# EAGLE design jack (EAGLE 7.3.0)
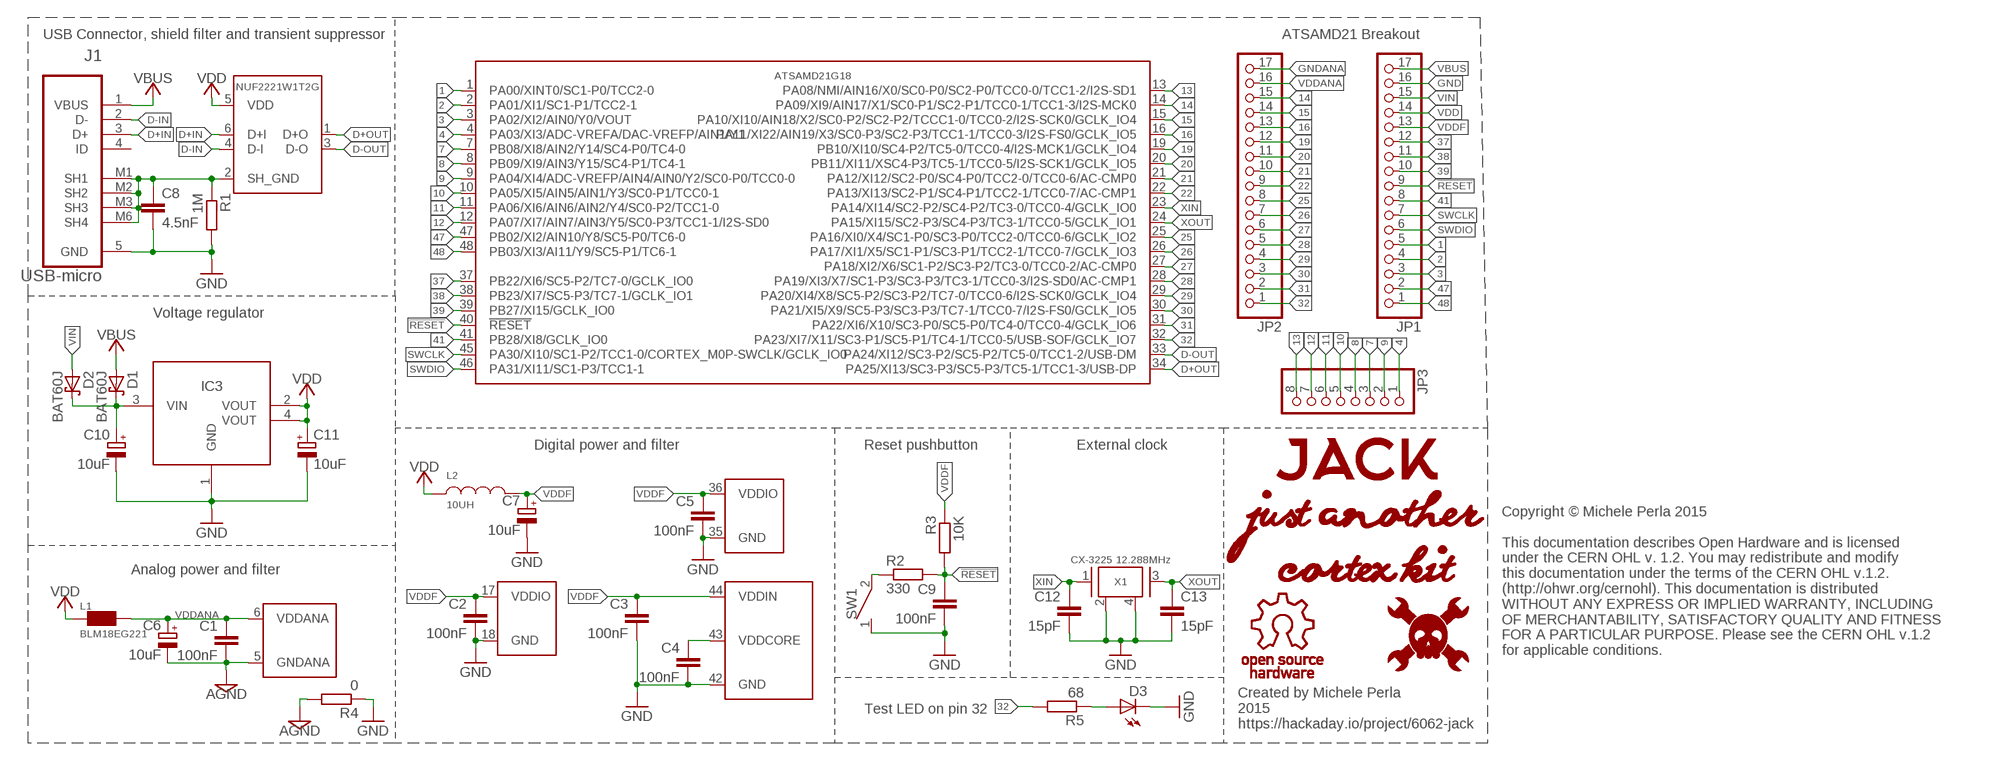
[diagram p0: schematic, sheet 1]

## Parts
C1  100nF  C-EU  [C0402]
C2  100nF  C-EU  [C0402]
C3  100nF  C-EU  [C0402]
C4  100nF  C-EU  [C0402]
C5  100nF  C-EU  [C0402]
C6  10uF  CPOL-EUCT3216  [CT3216]
C7  10uF  CPOL-EUCT3216  [CT3216]
C8  4.5nF  C-EU  [C0402]
C9  100nF  C-EU  [C0402]
C10  10uF  CPOL-EUCT3216  [CT3216]
C11  10uF  CPOL-EUCT3216  [CT3216]
C12  15pF  C-EU  [C0402]
C13  15pF  C-EU  [C0402]
D1  BAT60J  [SOD323_ST]
D2  BAT60J  [SOD323_ST]
D3  LED  [LED-0603]
IC1  NUF2221W1T2G  [SOT-363]
IC2  ATSAMD21G18  [TQFP48]
IC3  LDO  [SOT-223-3]
J1  USB-micro  47346-0001  [MOLEX_47346-0001]
JP1  PINHD-1X17  [1X17]
JP2  PINHD-1X17  [1X17]
JP3  PINHD-1X8  [1X08]
L1  BLM18EG221  L  [0603]
L2  10UH  ELLVFG100MC-VXG  [IND_ELLVXG]
R1  1M  R-EU  [R0603]
R2  330  R-EU  [R0603]
R3  10K  R-EU  [R0603]
R4  0  R-EU  [R0603]
R5  68  R-EU  [R0603]
SW1  SPST3.5X6MM  [SWITCH-SMD-3.5X6MM]
U$3  JACK-LOGO  [JACK-LOGO]
U$5  HAD-LOGO  [HAD-LOGO]
U$6  OSHW-LOGO  [OSHW-LOGO]
X1  CX-3225 12.288MHz  XTALCX-3225  [CX-3225]

## Nets
1: IC2.1(IO:PA00/XINT0/SC1-P0/TCC2-0) JP1.5
2: IC2.2(IO:PA01/XI1/SC1-P1/TCC2-1) JP1.4
3: IC2.3(IO:PA02/XI2/AIN0/Y0/VOUT) JP1.3
4: IC2.4(IO:PA03/XI3/ADC-VREFA/DAC-VREFP/AIN1/Y1) JP3.1
7: IC2.7(IO:PB08/XI8/AIN2/Y14/SC4-P0/TC4-0) JP3.3
8: IC2.8(IO:PB09/XI9/AIN3/Y15/SC4-P1/TC4-1) JP3.4
9: IC2.9(IO:PA04/XI4/ADC-VREFP/AIN4/AIN0/Y2/SC0-P0/TCC0-0) JP3.2
10: IC2.10(IO:PA05/XI5/AIN5/AIN1/Y3/SC0-P1/TCC0-1) JP3.5
11: IC2.11(IO:PA06/XI6/AIN6/AIN2/Y4/SC0-P2/TCC1-0) JP3.6
12: IC2.12(IO:PA07/XI7/AIN7/AIN3/Y5/SC0-P3/TCC1-1/I2S-SD0) JP3.7
13: IC2.13(IO:PA08/NMI/AIN16/X0/SC0-P0/SC2-P0/TCC0-0/TCC1-2/I2S-SD1) JP3.8
14: IC2.14(IO:PA09/XI9/AIN17/X1/SC0-P1/SC2-P1/TCC0-1/TCC1-3/I2S-MCK0) JP2.15
15: IC2.15(IO:PA10/XI10/AIN18/X2/SC0-P2/SC2-P2/TCCC1-0/TCC0-2/I2S-SCK0/GCLK_IO4) JP2.14
16: IC2.16(IO:PA11/XI22/AIN19/X3/SC0-P3/SC2-P3/TCC1-1/TCC0-3/I2S-FS0/GCLK_IO5) JP2.13
19: IC2.19(IO:PB10/XI10/SC4-P2/TC5-0/TCC0-4/I2S-MCK1/GCLK_IO4) JP2.12
20: IC2.20(IO:PB11/XI11/XSC4-P3/TC5-1/TCC0-5/I2S-SCK1/GCLK_IO5) JP2.11
21: IC2.21(IO:PA12/XI12/SC2-P0/SC4-P0/TCC2-0/TCC0-6/AC-CMP0) JP2.10
22: IC2.22(IO:PA13/XI13/SC2-P1/SC4-P1/TCC2-1/TCC0-7/AC-CMP1) JP2.9
25: IC2.25(IO:PA16/XI0/X4/SC1-P0/SC3-P0/TCC2-0/TCC0-6/GCLK_IO2) JP2.8
26: IC2.26(IO:PA17/XI1/X5/SC1-P1/SC3-P1/TCC2-1/TCC0-7/GCLK_IO3) JP2.7
27: IC2.27(IO:PA18/XI2/X6/SC1-P2/SC3-P2/TC3-0/TCC0-2/AC-CMP0) JP2.6
28: IC2.28(IO:PA19/XI3/X7/SC1-P3/SC3-P3/TC3-1/TCC0-3/I2S-SD0/AC-CMP1) JP2.5
29: IC2.29(IO:PA20/XI4/X8/SC5-P2/SC3-P2/TC7-0/TCC0-6/I2S-SCK0/GCLK_IO4) JP2.4
30: IC2.30(IO:PA21/XI5/X9/SC5-P3/SC3-P3/TC7-1/TCC0-7/I2S-FS0/GCLK_IO5) JP2.3
31: IC2.31(IO:PA22/XI6/X10/SC3-P0/SC5-P0/TC4-0/TCC0-4/GCLK_IO6) JP2.2
32: IC2.32(IO:PA23/XI7/X11/SC3-P1/SC5-P1/TC4-1/TCC0-5/USB-SOF/GCLK_IO7) JP2.1 R5.2
37: IC2.37(IO:PB22/XI6/SC5-P2/TC7-0/GCLK_IO0) JP1.12
38: IC2.38(IO:PB23/XI7/SC5-P3/TC7-1/GCLK_IO1) JP1.11
39: IC2.39(IO:PB27/XI15/GCLK_IO0) JP1.10
41: IC2.41(IO:PB28/XI8/GCLK_IO0) JP1.8
47: IC2.47(IO:PB02/XI2/AIN10/Y8/SC5-P0/TC6-0) JP1.2
48: IC2.48(IO:PB03/XI3/AI11/Y9/SC5-P1/TC6-1) JP1.1
!RESET: C9.1 IC2.40(IO:!RESET) JP1.9 R2.2 R3.2
D+IN: IC1.6(D+I) J1.3(D+)
D+OUT: IC1.1(D+O) IC2.34(IO:PA25/XI13/SC3-P3/SC5-P3/TC5-1/TCC1-3/USB-DP)
D-IN: IC1.4(D-I) J1.2(D-)
D-OUT: IC1.3(D-O) IC2.33(IO:PA24/XI12/SC3-P2/SC5-P2/TC5-0/TCC1-2/USB-DM)
GND: C2.2 C3.2 C4.2 C5.2 C7.- C8.2 C9.2 C10.- C11.- C12.2 C13.2 D3.C IC2.18(PWR-IO1:GND) IC2.35(PWR-IO2:GND) IC2.42(PWR-IN-CORE:GND) IC3.1(GND) J1.5(GND) JP1.16 R1.2 R4.1 SW1.1 X1.2(GND) X1.4(GND)
GNDANA: C1.2 C6.- IC2.5(PWR-ANA:GNDANA) JP2.17 R4.2 ; supply symbol labelled AGND
LDOIN: C10.+ D1.C D2.C IC3.3(VIN)
N$1: D3.A R5.1
N$3: R2.1 SW1.2
SH_GND: C8.1 IC1.2(SH_GND) J1.M1(SH1) J1.M2(SH2) J1.M3(SH3) J1.M6(SH4) R1.1
SWCLK: IC2.45(IO:PA30/XI10/SC1-P2/TCC1-0/CORTEX_M0P-SWCLK/GCLK_IO0) JP1.7
SWDIO: IC2.46(IO:PA31/XI11/SC1-P3/TCC1-1) JP1.6
VBUS: D1.A J1.1(VBUS) JP1.17
VDD: C11.+ IC1.5(VDD) IC3.2(VOUT) IC3.4(VOUT) JP1.14 L1.1 L2.2
VDDANA: C1.1 C6.+ IC2.6(PWR-ANA:VDDANA) JP2.16 L1.2
VDDCORE: C4.1 IC2.43(PWR-IN-CORE:VDDCORE)
VDDF: C2.1 C3.1 C5.1 C7.+ IC2.17(PWR-IO1:VDDIO) IC2.36(PWR-IO2:VDDIO) IC2.44(PWR-IN-CORE:VDDIN) JP1.13 L2.1 R3.1
VIN: D2.A JP1.15
XIN: C12.1 IC2.23(IO:PA14/XI14/SC2-P2/SC4-P2/TC3-0/TCC0-4/GCLK_IO0) X1.1
XOUT: C13.1 IC2.24(IO:PA15/XI15/SC2-P3/SC4-P3/TC3-1/TCC0-5/GCLK_IO1) X1.3
Unconnected: J1.4(ID)

## Notes on the sheet
- USB Connector, shield filter and transient suppressor | ATSAMD21 Breakout
- Voltage regulator
- Digital power and filter | Reset pushbutton | External clock
- Analog power and filter
- Copyright © Michele Perla 2015
  
  This documentation describes Open Hardware and is licensed 
  under the CERN OHL v. 1.2. You may redistribute and modify 
  this documentation under the terms of the CERN OHL v.1.2. 
  (http://ohwr.org/cernohl). This documentation is distributed
  WITHOUT ANY EXPRESS OR IMPLIED WARRANTY, INCLUDING 
  OF MERCHANTABILITY, SATISFACTORY QUALITY AND FITNESS
  FOR A PARTICULAR PURPOSE. Please see the CERN OHL v.1.2
  for applicable conditions.
- Test LED on pin 32
- Created by Michele Perla
  2015
  https://hackaday.io/project/6062-jack

## Library data of the parts
C1-C5 C8 C9 C12 C13 = jack:C-EU
C6 C7 C10 C11 = jack:CPOL-EU
D1 D2 = diode:BAT60J: Schottky barrier diode Source: www.st.com, BAT60J.pdf; EAGLEUP: SOD323
D3 = jack:LED: Blue LED Mouser Part 720-LBQ39EN1P1351
IC1 = jack:NUF2221W1T2G: ON SEMICONDUCTOR NUF2221W1T2G IC, FILTER, USB, ESD PROTECTION, SOT363; EAGLEUP: SOT363
IC2 = jack:ATSAMD21G18
IC3 = jack:LDO; EAGLEUP: SOT223
J1 = Molex-47346-0001:47346-0001: CONN RCPT 5POS MICRO USB R/A SMD; MPN: 47346-0001; OC_FARNELL: 1568026; OC_NEWARK: 47M0505; PACKAGE: 5 POS MICRO USB R/A; SUPPLIER: MOLEX
JP1 JP2 = pinhead:PINHD-1X17: PIN HEADER
JP3 = pinhead:PINHD-1X8: PIN HEADER
L1 = jack:L: Ferrite bead; EAGLEUP: R0603
L2 = Panasonic-ELL:ELL: Choke Coils; EAGLEUP: ELLVFG; MPN: ELLVFG100MC; OC_FARNELL: 1717407; OC_NEWARK: 15R1033; PACKAGE: 3X3X1.2MM; SUPPLIER: PANASONIC
R1-R5 = jack:R-EU
SW1 = jack:SPST: Tactile Switches 3.5X6 SMT TACT TACT SWITCH - Mouser part # 506-FSMSM; EAGLEUP: MOM-1181
U$3 = jack:JACK-LOGO
U$5 = jack:HAD-LOGO
U$6 = jack:OSHW-LOGO
X1 = jack:XTAL; EAGLEUP: CX3225

## Board
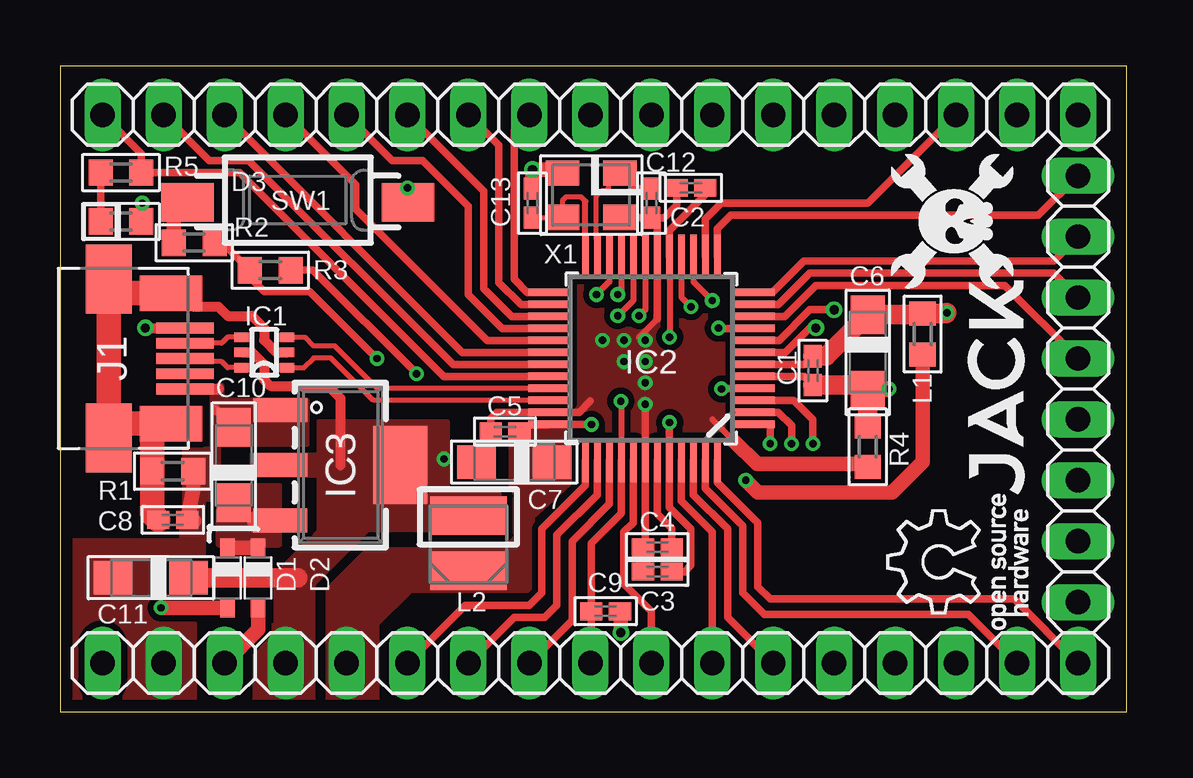
[diagram p1: board, top side]
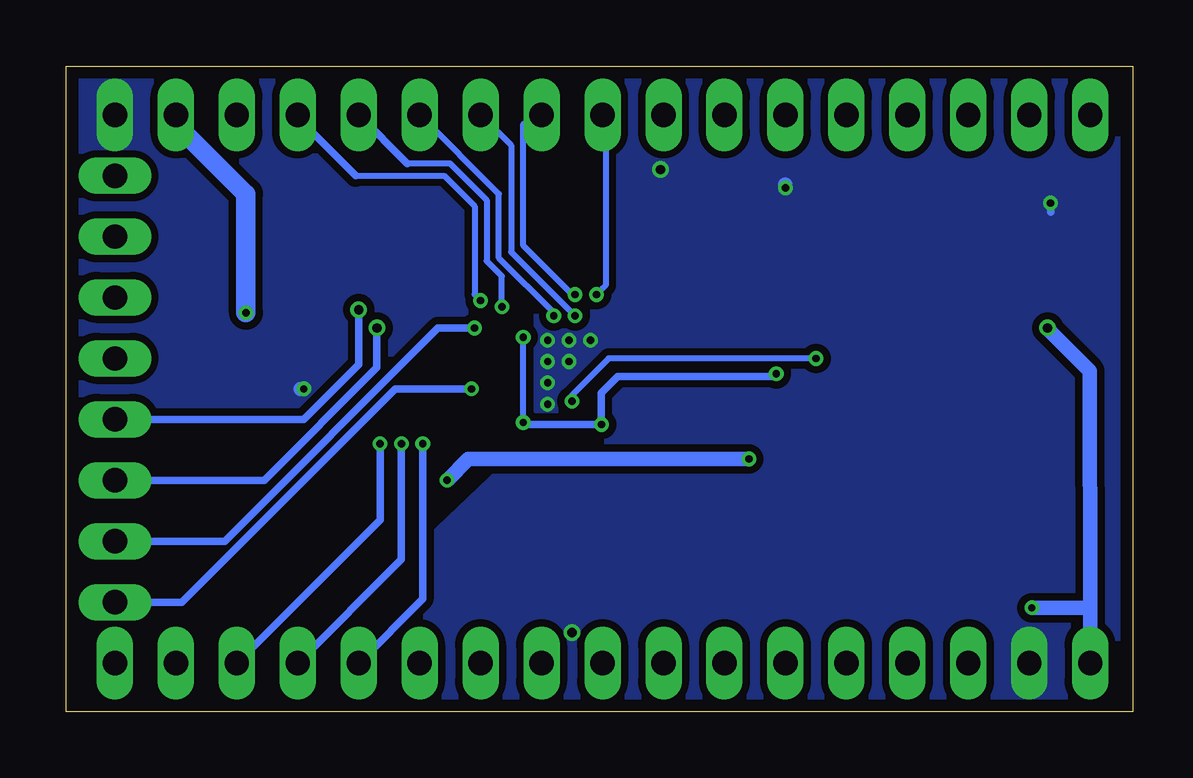
[diagram p2: board, bottom side, seen from below]

Size 44.45 x 26.92 mm. Coordinates in mm from the lower left corner, seen from the top.
Outline: 0,0 44.45,0 44.45,26.92 0,26.92 0,0
Copper layers (1*16): Top 0.035mm / dielectric 1.5mm / Bottom 0.035mm
Design rules "EagleRules": minimum track width 7mil, minimum drill 12mil, track to track 7mil, track to pad 7mil, pad to pad 7mil, via to via 7mil, smd to smd 0mil, copper to edge 20mil, drill to drill 10mil, minimum pad ring 10mil, minimum via ring 6mil, stop-mask expansion 2mil, vias tented up to drill 25mil, thermal gap 10mil

### Footprints (pad centres in the part's own frame; a part is rotated, then mirrored left to right if it is on the bottom)
C0402 = smd 0.925 x 0.74: 1 -0.6,0; 2 0.6,0
CT3216 = smd 1.6 x 1.4: + -1.575,0; - 1.575,0
SOD323_ST = smd 0.8 x 0.6: A 1.25,0; C -1.25,0
LED-0603 = smd 1 x 1.1: A -0.85,0; C 0.85,0
SOT-363 = smd 0.6 x 0.4: 1 -0.953,0.635; 2 -0.953,0; 3 -0.953,-0.635; 4 0.953,-0.635; 5 0.953,0; 6 0.953,0.635
TQFP48 = smd 1.8 x 0.3: 1 -4.25,2.75; 2 -4.25,2.25; 3 -4.25,1.75; 4 -4.25,1.25; 5 -4.25,0.75; 6 -4.25,0.25; 7 -4.25,-0.25; 8 -4.25,-0.75; 9 -4.25,-1.25; 10 -4.25,-1.75; 11 -4.25,-2.25; 12 -4.25,-2.75; 25 4.25,-2.75; 26 4.25,-2.25; 27 4.25,-1.75; 28 4.25,-1.25; 29 4.25,-0.75; 30 4.25,-0.25; 31 4.25,0.25; 32 4.25,0.75; 33 4.25,1.25; 34 4.25,1.75; 35 4.25,2.25; 36 4.25,2.75 | smd 0.3 x 1.8: 13 -2.75,-4.25; 14 -2.25,-4.25; 15 -1.75,-4.25; 16 -1.25,-4.25; 17 -0.75,-4.25; 18 -0.25,-4.25; 19 0.25,-4.25; 20 0.75,-4.25; 21 1.25,-4.25; 22 1.75,-4.25; 23 2.25,-4.25; 24 2.75,-4.25; 37 2.75,4.25; 38 2.25,4.25; 39 1.75,4.25; 40 1.25,4.25; 41 0.75,4.25; 42 0.25,4.25; 43 -0.25,4.25; 44 -0.75,4.25; 45 -1.25,4.25; 46 -1.75,4.25; 47 -2.25,4.25; 48 -2.75,4.25
SOT-223-3 = smd 1 x 2.25: 1 -2.3,-2.5; 2 0,-2.5; 3 2.3,-2.5 | smd 3.25 x 2.25: 4 0,2.5
MOLEX_47346-0001 = smd 0.45 x 2.388: 1 -1.27,0.508; 2 -0.635,0.508; 3 0,0.508; 4 0.635,0.508; 5 1.27,0.508 | smd 1.475 x 2.6: M1 -2.718,-0.081; M2 2.718,-0.081 | smd 2.875 x 1.9: M3 -3.321,-2.667; M6 3.321,-2.667
1X17 = drill 1.016 long: 1 -20.32,0; 2 -17.78,0; 3 -15.24,0; 4 -12.7,0; 5 -10.16,0; 6 -7.62,0; 7 -5.08,0; 8 -2.54,0; 9 0,0; 10 2.54,0; 11 5.08,0; 12 7.62,0; 13 10.16,0; 14 12.7,0; 15 15.24,0; 16 17.78,0; 17 20.32,0
1X08 = drill 1.016 long: 1 -8.89,0; 2 -6.35,0; 3 -3.81,0; 4 -1.27,0; 5 1.27,0; 6 3.81,0; 7 6.35,0; 8 8.89,0
0603 = smd 1 x 1.1: 1 -0.85,0; 2 0.85,0
IND_ELLVXG = smd 1.6 x 3.2: 1 -1.1,0; 2 1.2,0
R0603 = smd 1 x 1.1: 1 -0.85,0; 2 0.85,0
SWITCH-SMD-3.5X6MM = smd 2.18 x 1.6: 1 -4.6,0.1; 2 4.6,0.1
CX-3225 = smd 1.4 x 1.05: 1 -1.2,-0.925; 2 1.2,-0.925; 3 1.2,0.925; 4 -1.2,0.925

### Placement (x,y rotation side)
C1  31.37,14.22 270 top
C2  26.29,21.84 180 top
C3  24.89,5.84 180 top
C4  24.89,6.86 180 top
C5  18.54,11.68 180 top
C6  33.66,14.99 270 top
C7  18.92,10.41 180 top
C8  4.7,8 0 top
C9  22.73,4.19 0 top
C10  7.24,10.29 90 top
C11  3.78,5.59 180 top
C12  24.64,21.21 270 top
C13  19.68,21.21 90 top
D1  6.99,5.59 270 top
D2  8.26,5.59 270 top
D3  2.54,20.45 0 top
IC1  8.51,14.99 180 top
IC2  24.64,14.73 180 top
IC3  11.68,10.29 270 top
J1  4.7,14.73 270 top
JP1  22.1,2.03 180 top
JP2  22.1,24.89 0 top
JP3  42.42,13.46 90 top
L1  35.94,15.75 90 top
L2  17.02,6.99 90 top
R1  4.7,10.03 0 top
R2  5.59,19.56 0 top
R3  8.76,18.41 180 top
R4  33.66,11.05 90 top
R5  2.54,22.48 0 top
SW1  9.91,21.34 180 top
U$3  39.12,13.21 90 top
U$5  37.59,20.45 90 top
U$6  37.21,6.22 90 top
X1  22.14,21.54 180 top

### Tracks (layer width: path | path; a pad name or v marks a point on that pad's centre or on a via)
1  (via drill 0.3 pad 0.61)
  Top 0.305: IC2.1 29.59,11.98 v29.59,11.18
  Bottom 0.305: v29.59,11.18 29.59,4.7 JP1.5
2  (via drill 0.3 pad 0.61)
  Top 0.305: IC2.2 29.94,12.48 30.48,11.94 v30.48,11.18
  Bottom 0.305: v30.48,11.18 30.48,6.35 JP1.4
3  (via drill 0.3 pad 0.61)
  Top 0.305: IC2.3 30.58,12.98 31.37,12.19 v31.37,11.18
  Bottom 0.305: v31.37,11.18 31.37,8 JP1.3
4  (via drill 0.3 pad 0.61)
  Top 0.305: IC2.4 27.71,13.48 v27.56,13.46
  Bottom 0.305: v27.56,13.46 30.73,13.46 39.62,4.57 JP3.1
7  (via drill 0.38 pad 0.61)
  Top 0.305: IC2.7 30.22,14.98 31.24,16 v31.5,16
  Bottom 0.305: v31.5,16 31.5,14.35 36.2,9.65 JP3.3
8  (via drill 0.38 pad 0.61)
  Top 0.305: IC2.8 29.96,15.48 31.24,16.76 v32.26,16.76
  Bottom 0.305: 32.13,16.64 v32.26,16.76 32.26,14.48 34.54,12.19 JP3.4
9  (via drill 0.3 pad 0.61)
  Top 0.305: IC2.9 27.45,15.98 v27.43,16
  Bottom 0.305: 27.3,16 v27.43,16 28.96,16 37.85,7.11 JP3.2
10
  Top 0.305: IC2.10 30.2,16.48 31.5,17.78 39.37,17.78 JP3.5
11
  Top 0.305: IC2.11 29.94,16.98 31.24,18.29 41.4,18.29 JP3.6
12
  Top 0.305: IC2.12 29.67,17.48 30.99,18.8 41.4,18.8 JP3.7
13
  Top 0.305: IC2.13 27.39,20.15 27.94,20.7 40.77,20.7 JP3.8
14
  Top 0.305: IC2.14 26.89,20.54 27.56,21.21 33.66,21.21 JP2.15
15  (via drill 0.3 pad 0.61)
  Top 0.254: IC2.15 26.39,17.93 v27.18,17.14
  Bottom 0.254: 32.38,22.35 28.7,22.35 27.43,21.08 27.43,17.4 v27.18,17.14
  Bottom 0.305: 32.38,22.35 34.8,24.77 JP2.14
16  (via drill 0.3 pad 0.61)
  Top 0.254: IC2.16 25.89,17.29 v26.29,16.89
  Bottom 0.254: v26.29,16.89 26.29,18.16 26.92,18.8 26.92,21.34 28.45,22.86 30.23,22.86
  Bottom 0.305: 30.23,22.86 JP2.13
19  (via drill 0.3 pad 0.61)
  Top 0.254: IC2.19 24.39,16.77 v24.13,16.51
  Bottom 0.254: v24.13,16.51 24.13,16.64 26.42,18.92 26.42,21.59 JP2.12
20  (via drill 0.3 pad 0.61)
  Top 0.254: IC2.20 23.89,17.16 v23.24,16.51
  Bottom 0.254: v23.24,16.51 25.91,19.18 25.91,23.62 JP2.11
21  (via drill 0.3 pad 0.61)
  Top 0.254: IC2.21 23.39,17.55 v23.24,17.4
  Bottom 0.254: v23.24,17.4 23.37,17.4 25.4,19.43 25.4,24.51 25.02,24.89 JP2.10
22  (via drill 0.3 pad 0.61)
  Top 0.254: IC2.22 22.89,17.93 v22.35,17.4
  Bottom 0.254: 22.1,17.65 v22.35,17.4 21.97,17.78 21.97,24.77 JP2.9
25
  Top 0.305: IC2.25 19.48,17.48 18.92,18.03 18.92,24.26 JP2.8
26
  Top 0.305: IC2.26 19.21,16.98 18.29,17.91 18.29,23.62 JP2.7
27
  Top 0.305: IC2.27 18.82,16.48 17.65,17.65 17.65,21.72 JP2.6
28
  Top 0.305: IC2.28 18.43,15.98 17.02,17.4 17.02,21.08 15.11,22.99 13.84,22.99 JP2.5
29
  Top 0.305: IC2.29 17.79,15.48 12.32,20.95 12.32,21.97 JP2.4
30
  Top 0.305: IC2.30 16.77,14.98 JP2.3
31
  Top 0.305: IC2.31 16.38,14.48 7.87,22.99 6.22,22.99 JP2.2
32
  Top 0.305: R5.2 3.43,22.48 | R5.2 3.39,23.28 JP2.1 | IC2.32 15.99,13.98 7.49,22.48 R5.2
37
  Top 0.305: IC2.37 21.89,9.44 20.07,7.62 20.07,4.95 19.56,4.45 16.89,4.45 JP1.12
38
  Top 0.305: IC2.38 22.39,9.05 20.7,7.37 20.7,4.45 20.19,3.94 18.92,3.94 JP1.11
39
  Top 0.305: IC2.39 22.89,8.66 21.34,7.11 21.34,3.81 JP1.10
41
  Top 0.305: IC2.41 23.89,7.89 23.5,7.49 23.5,5.33 24.64,4.19 JP1.8
47
  Top 0.305: IC2.47 26.89,9.31 28.45,7.75 28.45,4.95 29.34,4.06 37.85,4.06 JP1.2
48
  Top 0.305: IC2.48 27.39,9.57 29.08,7.87 29.08,5.21 29.59,4.7 39.75,4.7 JP1.1
!RESET  (via drill 0.3 pad 0.61)
  Top 0.254: v23.37,12.95 23.39,12.93 IC2.40
  Top 0.305: IC2.40 23.39,8.28 22.13,7.02 C9.1 22.13,2.07 | R2.2 6.77,19.56 R3.2 7.79,18.25 8.51,17.53 10.41,17.53 v13.21,14.73
  Top 0.813: 22.13,2.07 22.1,2.07 JP1.9
  Bottom 0.254: v13.21,14.73 21.84,14.73 23.37,13.21 v23.37,12.95
D+IN
  Top 0.203: IC1.6 6.99,14.35 6.73,14.61 5.33,14.61 J1.3
D+OUT
  Top 0.203: IC1.1 10.16,14.35 10.57,14.76 11.28,14.76 13.05,12.98 IC2.34
D-IN
  Top 0.203: IC1.4 6.99,15.62 6.73,15.37 J1.2
D-OUT
  Top 0.203: IC1.3 10.2,15.62 10.56,15.26 11.45,15.26 13.23,13.48 IC2.33
GND  (via drill 0.3 pad 0.61, 0.38 pad 0.61)
  Top 0.254: 28.07,11.3 27.18,12.19 | 24.89,16.38 24.13,15.62
  Top 0.305: 5.68,9.14 5.55,9.27 | C4.2 24.39,7.27 IC2.42 24.39,12.95 | 22.1,12.95 21.63,12.48 IC2.35 18.2,12.48 17.94,12.23 C5.2 17.94,10.41 C7.- | C12.2 24.89,20.36 IC2.18 24.89,16.39 24.89,16.38 | X1.4 C12.2 | C2.2 25.69,21.12 25.15,20.57 24.67,20.57 C12.2 | D3.C 3.39,21.17 v3.43,21.21
  Top 0.406: 20.67,22.73 X1.2 | 19.68,22.73 v19.68,22.61 | 6.49,12.59 6.48,12.57
  Top 0.457: J1.5 6.6,13.46
  Top 0.61: R1.2 5.55,9.27 C8.2 5.59,7.96 | 28.07,11.3 29.04,10.33 33.53,10.33 R4.1 | C9.2 23.37,4.16 v23.37,3.3 | C3.2 C4.2 | SW1.1 14.51,21.82 v14.48,21.84 | X1.2 20.94,22.61 v19.68,22.61 C13.2
  Bottom 0.305: v3.43,21.21 3.43,20.83
  Bottom 0.61: v14.48,21.84 14.48,21.97
  other vias: 22.61,15.49 23.5,14.61 23.5,15.49 24.38,15.49 24.38,14.61 24.38,13.72 24.38,12.83
  pour Bottom (isolate 0.305, no thermals): 0,26.92 24.38,26.92 25.02,11.3 35.31,1.52 34.8,0 0,0
  pour Top (isolate 0.254, no thermals): 21.21,12.7 21.21,17.53 21.84,18.16 27.43,18.16 28.07,17.53 28.07,11.94 27.43,11.3 22.61,11.3
  pour Top (isolate 0.254, no thermals): 5.21,7.62 5.97,7.62 5.97,8.89 7.24,8.89 7.24,9.4 6.6,9.4 6.6,11.18 10.29,11.18 10.29,12.95 6.73,12.95 6.73,13.59 6.35,13.59 6.35,10.92 5.21,10.92
  pour Top (isolate 0.254, no thermals): 5.08,7.62 5.08,7.11 0,7.11 0,0 5.59,0 5.59,3.68 4.32,3.68 4.32,5.71 5.97,5.71 5.97,7.62
GNDANA  (via drill 0.3 pad 0.61)
  Top 0.305: IC2.5 31.01,13.98 C1.2 | 33.44,13.62 C6.-
  Top 0.61: C6.- 34.49,13.41 v34.54,13.46
  Top 0.813: R4.2 C6.- 33.66,13.62 C1.2
  Bottom 0.61: v34.54,13.46 34.67,13.46
  pour Bottom (isolate 0.305, no thermals): 25.27,26.92 25.78,12.45 26.92,11.3 27.81,11.3 36.45,3.56 35.94,0 44.45,0 44.45,26.92
LDOIN
  Top 0.254: 8.11,7.79 IC3.3
  Top 0.61: 8.09,8.04 IC3.3 8.05,8 | 8.11,7.79 8.13,7.77 | D1.C D2.C
  pour Top (isolate 0.254, no thermals): 7.75,9.4 7.75,8.38 6.6,8.38 6.6,6.99 9.14,6.99 9.14,9.4
N$1
  Top 0.305: R5.1 D3.A
N$3
  Top 0.61: SW1.2 4.74,20.67 R2.1
SH_GND
  Top 0.406: IC1.2 9.02,14.99 8.51,15.49 8.51,16 8,16.51 6.99,16.51 6.6,16.89 5.59,16.89 5.03,17.45 J1.M1
  Top 0.61: 2.08,12.01 2.03,12.06 J1.M6 2.09,11.41 | J1.M3 2.16,17.93 2.16,17.53 2.23,17.45 2.03,17.25
  Top 1.016: 3.85,11.72 R1.1 3.85,8.25 C8.1 | 3.85,11.72 4.06,11.94 4.54,11.94 J1.M2 | 2.08,12.01 3.56,12.01 3.85,11.72 | 2.03,12.06 J1.M3 | 2.23,17.45 J1.M1
SWCLK
  Top 0.305: IC2.45 25.89,8.78 27.18,7.49 JP1.7
SWDIO
  Top 0.305: IC2.46 26.39,9.04 27.81,7.62 27.81,3.94 JP1.6
VBUS  (via drill 0.3 pad 0.61, 0.38 pad 0.61)
  Top 0.254: 5.11,16.08 5.13,16.08 J1.1
  Top 0.406: v3.56,16 J1.1
  Top 0.61: v4.21,4.34 D1.A
  Bottom 0.61: 1.78,4.32 v4.21,4.34 1.8,4.34 1.78,4.32 | 1.78,4.32 1.78,4.57 | 1.78,4.57 1.8,14.2 3.56,15.96 v3.56,16 | JP1.17 1.78,4.57
VDD  (via drill 0.3 pad 0.61)
  Top 0.406: IC1.5 8,14.99 8.51,14.48 8.51,13.84 8.76,13.59 11.18,13.59 11.68,13.08 11.68,10.29
  Top 0.61: v28.57,9.65 29.08,9.14 34.67,9.14 35.94,10.41 L1.1
  Top 0.813: C11.+ 9.91,5.59
  Bottom 0.61: v16,10.54 27.69,10.54 v28.57,9.65
  pour Top (isolate 0.254, no thermals): 10.79,12.06 10.79,10.67 8,10.67 8,9.91 10.79,9.91 10.79,7.49 9.02,5.71 9.02,3.56 8.13,3.56 8.13,0 10.54,0 10.54,5.33 12.83,7.62 18.29,7.62 18.29,9.14 16.13,9.14 16.13,12.06
VDDANA  (via drill 0.3 pad 0.61)
  Top 0.305: IC2.6 31.03,14.48 C1.1
  Top 0.813: C1.1 31.92,14.82 C6.+ 35.9,16.56 L1.2 36.92,16.6 v36.96,16.64
  Bottom 0.813: v36.96,16.64 36.96,21.59 39.62,24.26 39.62,24.64 JP2.16
VDDCORE
  Top 0.305: IC2.43 24.89,8.26 25.49,7.66 C4.1
VDDF  (via drill 0.3 pad 0.61)
  Top 0.254: 19.56,11.94 20.34,11.94 IC2.36 | IC2.17 v25.4,15.62
  Top 0.305: 25.39,12.05 IC2.44 25.39,8.52 26.29,7.62 26.29,6.1 26.04,5.84 C3.1 | 25.32,11.98 25.39,12.05 | 25.39,12.05 v25.4,12.06 | IC2.36 v22.14,11.98 | IC2.17 25.39,20.05 26.89,21.55 C2.1 | R3.1 10.54,18.41 v14.86,14.1
  Bottom 0.254: v25.4,12.06 v25.4,15.62
  Bottom 0.305: v25.4,12.06 25.32,11.98 v22.14,11.98 22.14,13.29 21.46,13.97 14.99,13.97 v14.86,14.1
  pour Top (isolate 0.254, no thermals): 18.8,11.94 18.8,6.73 12.83,6.73 11.18,5.08 11.18,0 13.21,0 13.21,3.68 14.61,5.08 19.68,5.08 19.68,8.13 21.21,9.53 21.21,11.94
VIN
  Top 0.61: D2.A 8.26,3.43 JP1.15
XIN
  Top 0.203: IC2.23 22.39,19.65 22.35,19.68 22.35,21.5 22.57,21.72 22.73,21.72 22.86,21.84 22.86,21.99 X1.1
  Top 0.305: X1.1 23.99,21.81 C12.1
XOUT
  Top 0.203: 21.89,21.29 21.72,21.46 21.08,21.46 20.94,21.32 X1.3 | C13.1 X1.3
  Top 0.254: IC2.24 21.89,21.29 | 20.95,20.63 X1.3

### Text on the board
tDocu: Copyright © Michele Perla 2015 / / This documentation describes Open Hardware and is licensed / under the CERN OHL v. 1.2. You may redistribute and modify / this documentation under the terms of the CERN OHL v.1.2. / (http://ohwr.org/cernohl). This documentation is distributed / WITHOUT ANY EXPRESS OR IMPLIED WARRANTY, INCLUDING / OF MERCHANTABILITY, SATISFACTORY QUALITY AND FITNESS / FOR A PARTICULAR PURPOSE. Please see the CERN OHL v.1.2 / for applicable conditions.